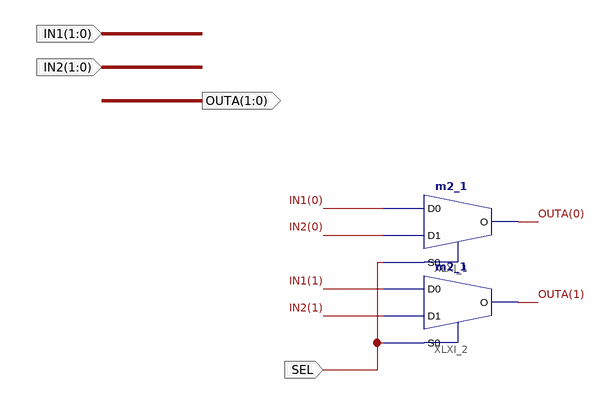
[diagram p0: schematic sheet 1]
// Xilinx ISE schematic MUX2_1_2BIT_V2.sch (spartan6) as structural Verilog: 2 symbols, 4 ports
module MUX2_1_2BIT_V2 (
  input  [1:0] IN1,
  input  [1:0] IN2,
  input  SEL,
  output [1:0] OUTA
);

  m2_1 XLXI_1 (.D0(IN1[0]), .D1(IN2[0]), .S0(SEL), .O(OUTA[0]));
  m2_1 XLXI_2 (.D0(IN1[1]), .D1(IN2[1]), .S0(SEL), .O(OUTA[1]));
endmodule
